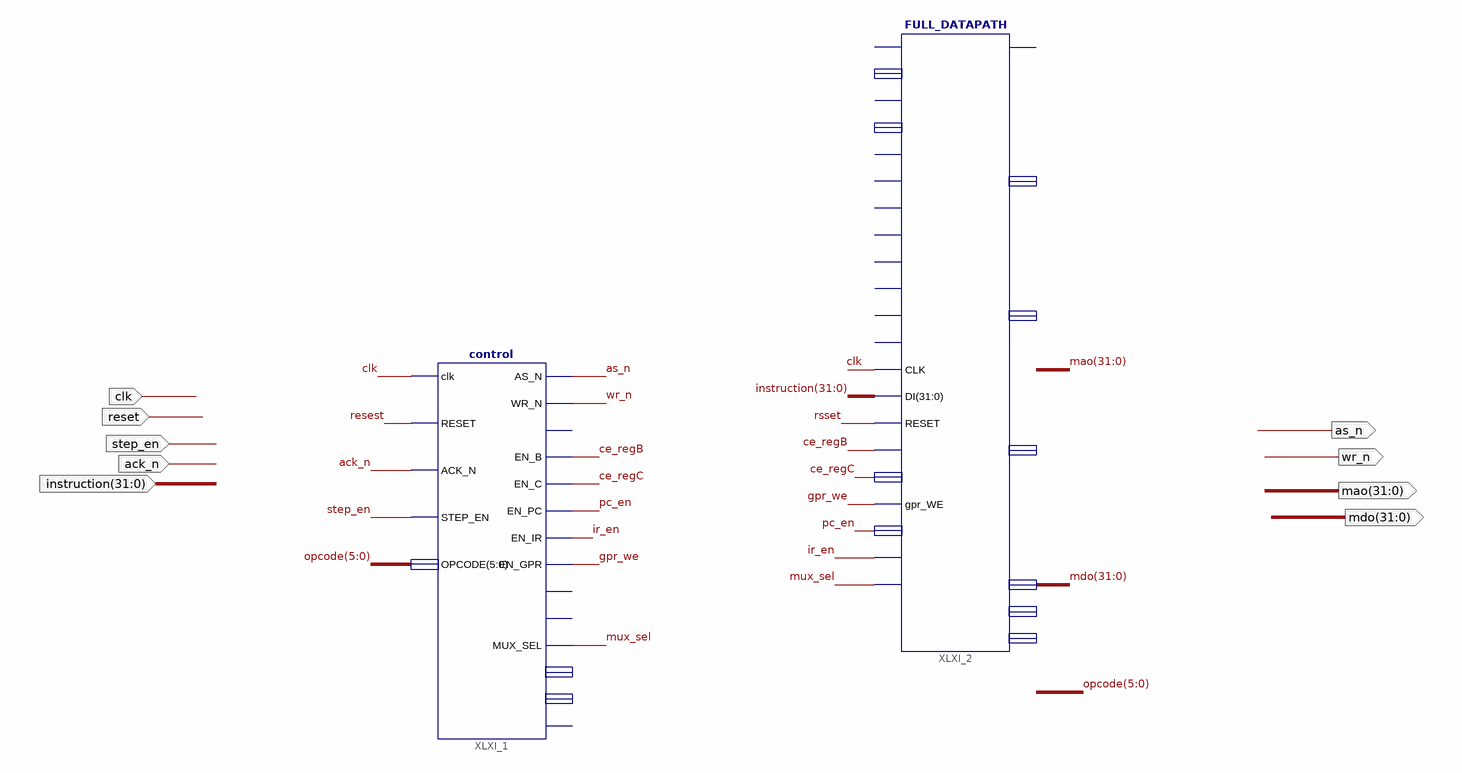
[diagram p0: schematic sheet 1]
// Xilinx ISE schematic control_datapth.sch (artix7) as structural Verilog: 2 symbols, 10 ports
module control_datapth (
  input  clk,
  input  resest,
  input  ack_n,
  input  step_en,
  input  [31:0] instruction,
  input  reset,
  output as_n,
  output wr_n,
  output [31:0] mao,
  output [31:0] mdo
);

  wire ce_regB, ce_regC, gpr_we, ir_en, mux_sel, pc_en, rsset;
  wire [5:0] opcode;

  FULL_DATAPATH XLXI_2 (
    .CLK(clk), .DI(instruction), .RESET(rsset), .gpr_WE(gpr_we), .OPCODE(opcode));  // open: MDR_sel, s1sel, PCce, Ace, Bce, Cce, MDRce, IRce, shift, right, test, add, Dadr, DINTsel, s2sel, MARce, Asel, AEQZ, D, func, MMU_AO, DO, IR
  control XLXI_1 (
    .clk(clk), .RESET(resest), .ACK_N(ack_n), .STEP_EN(step_en), .OPCODE(opcode), .AS_N(as_n), .WR_N(wr_n),
    .EN_B(ce_regB), .EN_C(ce_regC), .EN_PC(pc_en), .EN_IR(ir_en), .EN_GPR(gpr_we), .MUX_SEL(mux_sel));  // open: MW, IN_INIT, MR, MAC_STATE, DLX_CONTROL_STATE, stop_n
endmodule
